# EAGLE design XX-Piezo-Reciever (EAGLE 8.7.0)
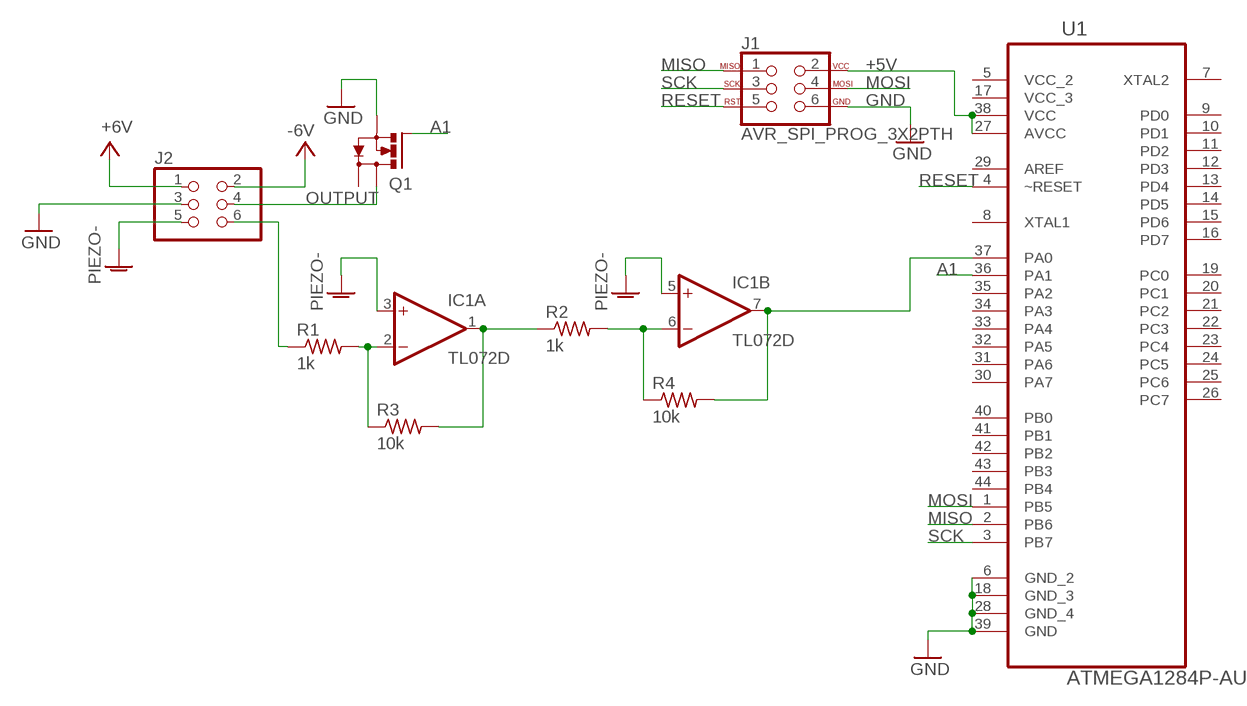
[diagram p0: schematic, sheet 1]

## Parts
IC1  TL072D  [SO08]
J1  AVR_SPI_PROG_3X2PTH  [2X3]
J2  PINHD-2X3  [2X03]
Q1  MOSFET_N_SOT223  [SOT223]
R1  1k  R-US_R0402  [R0402]
R2  1k  R-US_R0402  [R0402]
R3  10k  R-US_R0402  [R0402]
R4  10k  R-US_R0402  [R0402]
U1  ATMEGA1284P-AU  [QFP80P1200X1200X120-44N]

## Nets
+5V: J1.2 U1.27(AVCC) U1.38(VCC)
+6V: J2.1
-6V: J2.2
A1: Q1.1(G) U1.36(PA1)
GND: J1.6 J2.3 Q1.3(S) U1.6(GND_2) U1.18(GND_3) U1.28(GND_4) U1.39(GND)
MISO: J1.1 U1.2(PB6)
MOSI: J1.4 U1.1(PB5)
OUT1: IC1.1(A:OUT) R2.1 R3.2
OUT2: IC1.7(B:OUT) R4.2 U1.37(PA0)
OUTPUT: J2.4 Q1.2(D)
PIEZO+: J2.6 R1.1
PIEZO+1: IC1.2(A:-IN) R1.2 R3.1
PIEZO+2: IC1.6(B:-IN) R2.2 R4.1
PIEZO-: IC1.3(A:+IN) IC1.5(B:+IN) J2.5
RESET: J1.5 U1.4(~RESET)
SCK: J1.3 U1.3(PB7)
Unconnected: Q1.4(D1) U1.7(XTAL2) U1.8(XTAL1) U1.9(PD0) U1.10(PD1) U1.11(PD2) U1.12(PD3) U1.13(PD4) U1.14(PD5) U1.15(PD6) U1.16(PD7) U1.19(PC0) U1.20(PC1) U1.21(PC2) U1.22(PC3) U1.23(PC4) U1.24(PC5) U1.25(PC6) U1.26(PC7) U1.29(AREF) U1.30(PA7) U1.31(PA6) U1.32(PA5) U1.33(PA4) U1.34(PA3) U1.35(PA2) U1.40(PB0) U1.41(PB1) U1.42(PB2) U1.43(PB3) U1.44(PB4)

## Power pins joined to a net without a drawn wire
+6V: IC1.8(P:V+)
-6V: IC1.4(P:V-)
VCC_2: U1.5(VCC_2)
VCC_3: U1.17(VCC_3)

## Library data of the parts
IC1 = linear3:TL072: OP AMP
J1 = SparkFun-Connectors:AVR_SPI_PROG_3X2: AVR ISP 6 Pin This is the reduced ISP connector for AVR programming. Common on Arduino. This footprint will take up less PCB space and can be used with a 10-pin to 6-pin adapter such as SKU: BOB-08508 **Special note about "TEST_POINT" package. The stop mask is on the top side, so if you want your programming test points to be on the bottom of your board, make sure to place this package on the bottom side of the board. This also ensure that the orientation to program from the bottom side will be correct. SparkFun Products: SparkFun ISP Pogo Adapter <https://www.sparkfun.com/products/11591> - NS Tiny AVR Programmer <https://www.sparkfun.com/products/11801> -PTH
J2 = SparkFun-Retired:PINHD-2X3: PIN HEADER
Q1 = m-pad-2.1:MOSFET_N_SOT223: n channel mosfets in the sot-223 package standard pinout ie. fairchildsemi.com: IRFL4105 NDT451AN NDT455N FDT439N FQT13N06L etc. digikey: NDT451ANCT-ND (good, cheap one from natsemi)
R1-R4 = rcl:R-US_: RESISTOR, American symbol
U1 = Atmel_By_element14_Batch_1-00:ATMEGA1284P-AU: Microcontroller with Programmable Flash; MPN: ATMEGA1284P-AU; OC_FARNELL: 1715480; OC_NEWARK: 15R0263; PACKAGE: TQFP-44; SUPPLIER: Atmel

## Board
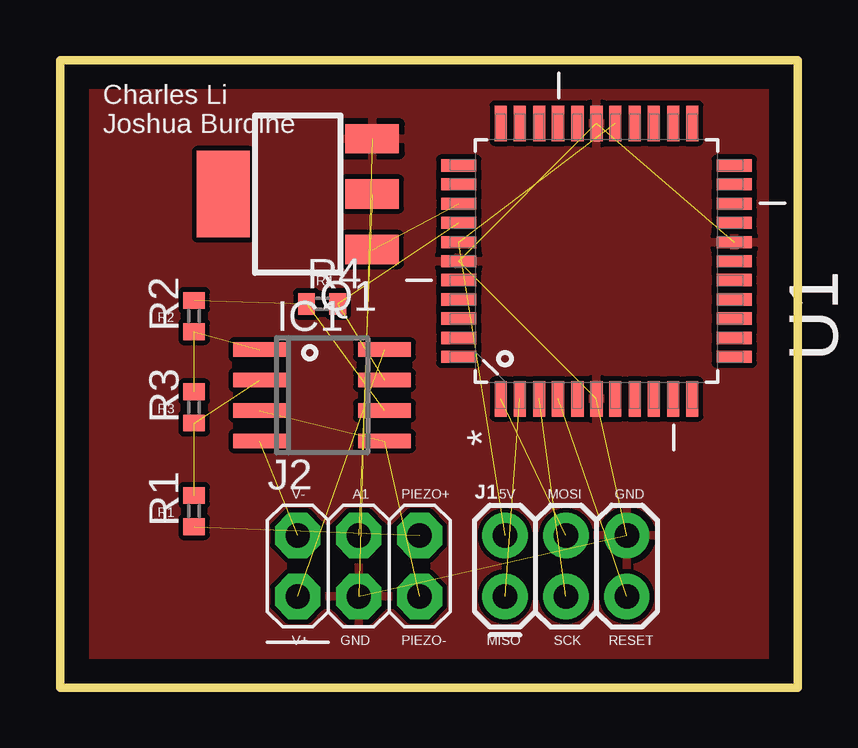
[diagram p1: board, top side]
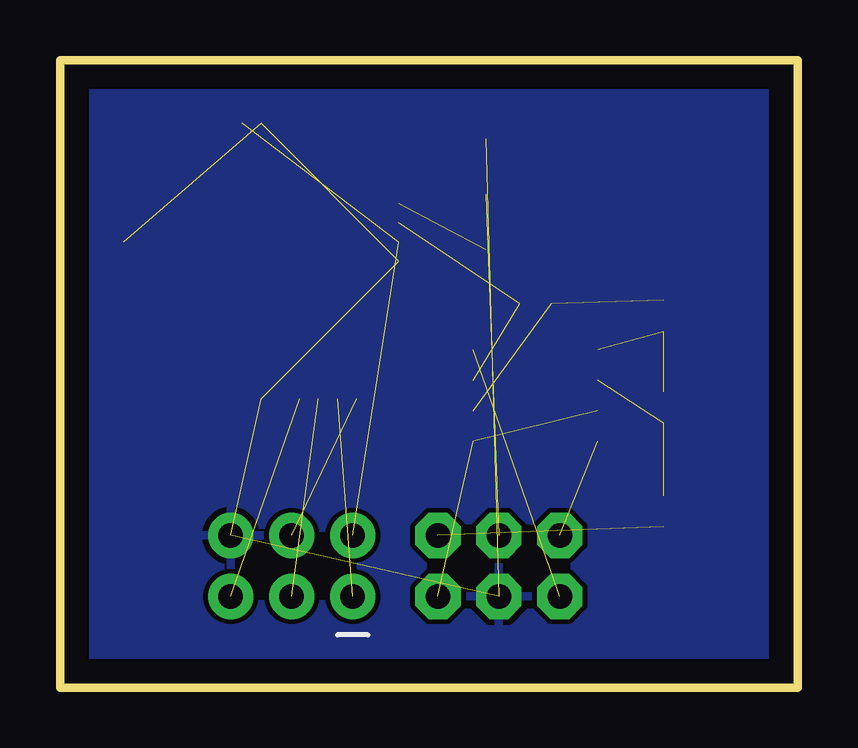
[diagram p2: board, bottom side, seen from below]

Size 30.73 x 26.16 mm. Coordinates in mm from the lower left corner, seen from the top.
Outline: 30.73,26.16 0,26.16 0,0 30.73,0 30.73,26.16
Copper layers (1*16): Top 0.035mm / dielectric 1.5mm / Bottom 0.035mm
Design rules "default *": minimum track width 6mil, minimum drill 0.35mm, track to track 8mil, track to pad 8mil, pad to pad 6mil, via to via 6mil, smd to smd 6mil, copper to edge 40mil, drill to drill 6mil, minimum pad ring 10mil, minimum via ring 8mil, stop-mask expansion 4mil, vias tented up to drill 0mil, thermal gap 10mil

### Footprints (pad centres in the part's own frame; a part is rotated, then mirrored left to right if it is on the bottom)
SO08 = smd 0.6 x 2.2: 1 -1.905,-2.6; 2 -0.635,-2.6; 3 0.635,-2.6; 4 1.905,-2.6; 5 1.905,2.6; 6 0.635,2.6; 7 -0.635,2.6; 8 -1.905,2.6
2X3 = drill 1.016 pad 1.88: 1 0,0; 2 0,2.54; 3 2.54,0; 4 2.54,2.54; 5 5.08,0; 6 5.08,2.54
2X03 = drill 1.016 pad 1.88 octagon: 1 -2.54,-1.27; 2 -2.54,1.27; 3 0,-1.27; 4 0,1.27; 5 2.54,-1.27; 6 2.54,1.27
SOT223 = smd 1.219 x 2.235: 1 -2.311,-3.099; 2 0,-3.099; 3 2.311,-3.099 | smd 3.6 x 2.2: 4 0,3.099
R0402 = smd 0.7 x 0.9: 1 -0.65,0; 2 0.65,0
QFP80P1200X1200X120-44N = smd 1.473 x 0.508: 1 -5.74,3.988; 2 -5.74,3.2; 3 -5.74,2.388; 4 -5.74,1.6; 5 -5.74,0.787; 6 -5.74,0; 7 -5.74,-0.787; 8 -5.74,-1.6; 9 -5.74,-2.388; 10 -5.74,-3.2; 11 -5.74,-3.988; 23 5.74,-3.988; 24 5.74,-3.2; 25 5.74,-2.388; 26 5.74,-1.6; 27 5.74,-0.787; 28 5.74,0; 29 5.74,0.787; 30 5.74,1.6; 31 5.74,2.388; 32 5.74,3.2; 33 5.74,3.988 | smd 0.508 x 1.473: 12 -3.988,-5.74; 13 -3.2,-5.74; 14 -2.388,-5.74; 15 -1.6,-5.74; 16 -0.787,-5.74; 17 0,-5.74; 18 0.787,-5.74; 19 1.6,-5.74; 20 2.388,-5.74; 21 3.2,-5.74; 22 3.988,-5.74; 34 3.988,5.74; 35 3.2,5.74; 36 2.388,5.74; 37 1.6,5.74; 38 0.787,5.74; 39 0,5.74; 40 -0.787,5.74; 41 -1.6,5.74; 42 -2.388,5.74; 43 -3.2,5.74; 44 -3.988,5.74

### Placement (x,y rotation side)
IC1  10.92,12.19 270 top
J1  18.54,3.81 0 top
J2  12.45,5.08 0 top
Q1  9.91,20.57 90 top
R1  5.59,7.37 90 top
R2  5.59,15.49 90 top
R3  5.59,11.68 90 top
R4  10.92,16 0 top
U1  22.35,17.78 90 top

### Tracks (layer width: path | path; a pad name or v marks a point on that pad's centre or on a via)
+5V  (2 unrouted)
+6V  (1 unrouted)
-6V  (1 unrouted)
A1  (1 unrouted)
GND  (6 unrouted)
  pour Top: 0,26.16 0,0 30.73,0 30.73,26.16
  pour Bottom: 0,0 30.73,0 30.73,26.16 0,26.16
MISO  (1 unrouted)
MOSI  (1 unrouted)
OUT1  (2 unrouted)
OUT2  (2 unrouted)
OUTPUT  (1 unrouted)
PIEZO+  (1 unrouted)
PIEZO+1  (2 unrouted)
PIEZO+2  (2 unrouted)
PIEZO-  (2 unrouted)
RESET  (1 unrouted)
SCK  (1 unrouted)

### Text on the board
tPlace: Charles Li / Joshua Burdine | R4 | R2 | R3 | V- | A1 | PIEZO+ | 5V | MOSI | GND | R1 | V+ | GND | PIEZO- | MISO | SCK | RESET